# Altium schematic sheet SoC_BootMode.SchDoc
size A4; SheetNumber: 17; SheetTotal: 22
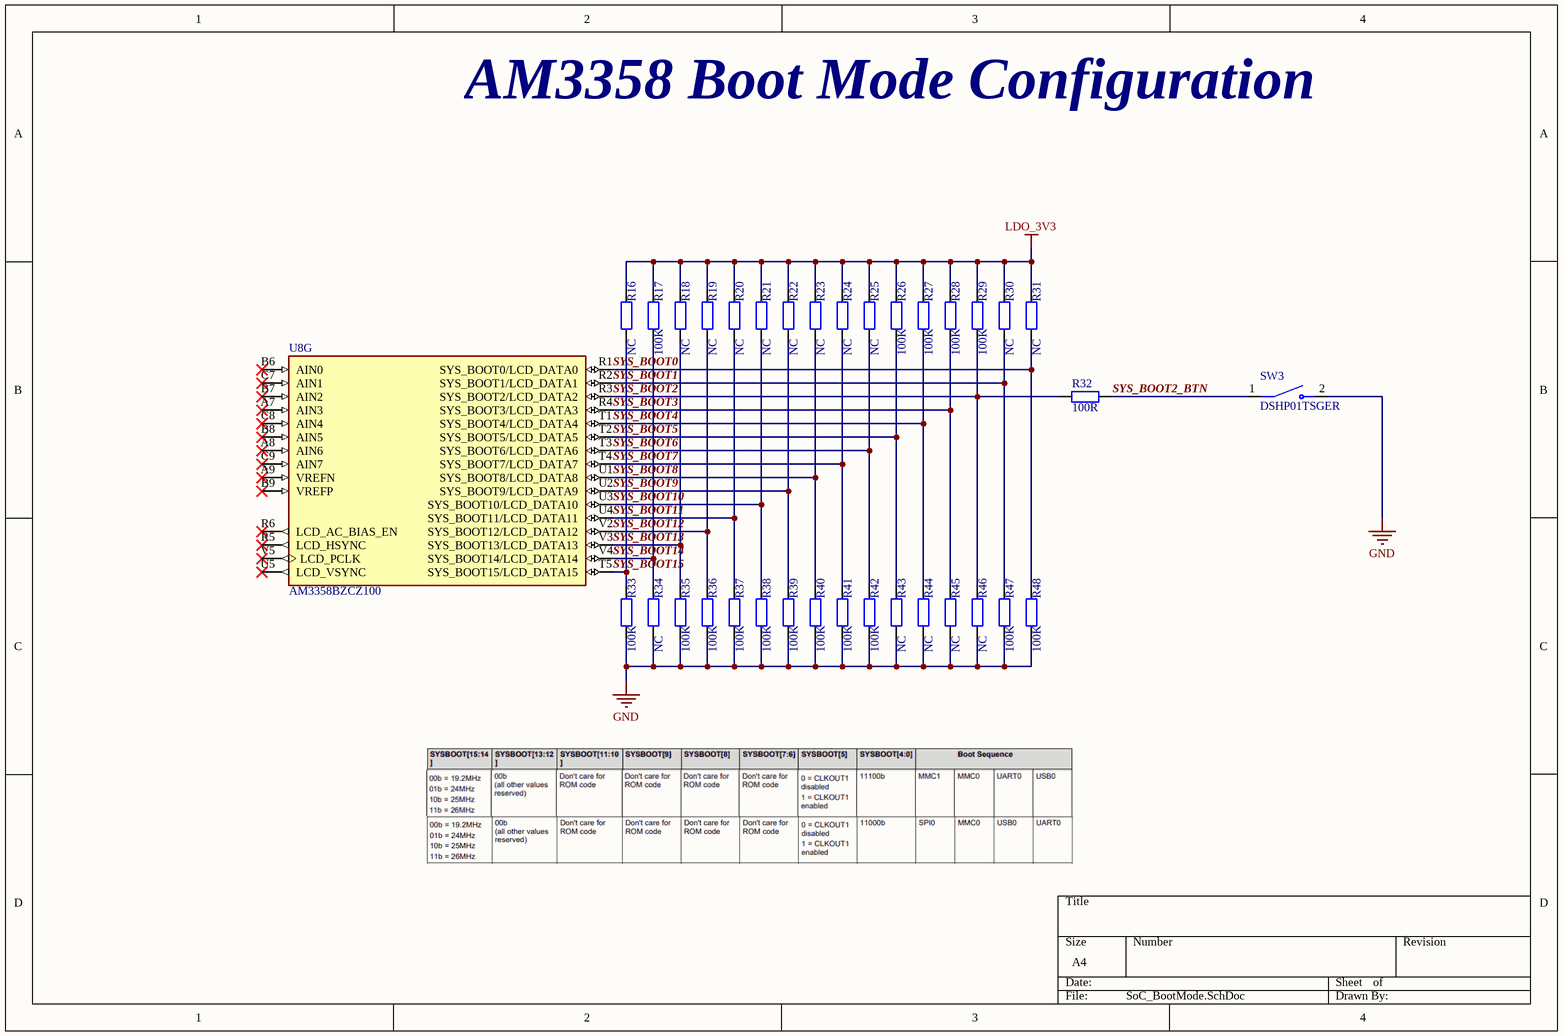
[diagram p0: SoC_BootMode.SchDoc]

## Parts
R16  NC  [R_0402]
R17  100K  [R_0402]
R18  NC  [R_0402]
R19  NC  [R_0402]
R20  NC  [R_0402]
R21  NC  [R_0402]
R22  NC  [R_0402]
R23  NC  [R_0402]
R24  NC  [R_0402]
R25  NC  [R_0402]
R26  100K  [R_0402]
R27  100K  [R_0402]
R28  100K  [R_0402]
R29  100K  [R_0402]
R30  NC  [R_0402]
R31  NC  [R_0402]
R32  100R  [R_0402]
R33  100K  [R_0402]
R34  NC  [R_0402]
R35  100K  [R_0402]
R36  100K  [R_0402]
R37  100K  [R_0402]
R38  100K  [R_0402]
R39  100K  [R_0402]
R40  100K  [R_0402]
R41  100K  [R_0402]
R42  100K  [R_0402]
R43  NC  [R_0402]
R44  NC  [R_0402]
R45  NC  [R_0402]
R46  NC  [R_0402]
R47  100K  [R_0402]
R48  100K  [R_0402]
SW3  DSHP01TSGER  [DSHP01TSGER]
U8  AM3358BZCZ100  [BGA324C80P18X18_1500X1500X140]  (part G of 9)

## Nets
GND: R33.1 R34.1 R35.1 R36.1 R37.1 R38.1 R39.1 R40.1 R41.1 R42.1 R43.1 R44.1 R45.1 R46.1 R47.1 R48.1 SW3.2(NO)
LDO_3V3: R16.2 R17.2 R18.2 R19.2 R20.2 R21.2 R22.2 R23.2 R24.2 R25.2 R26.2 R27.2 R28.2 R29.2 R30.2 R31.2
SYS_BOOT0: R31.1 R48.2 U8.R1(SYS_BOOT0/LCD_DATA0)
SYS_BOOT1: R30.1 R47.2 U8.R2(SYS_BOOT1/LCD_DATA1)
SYS_BOOT2: R29.1 R32.1 R46.2 U8.R3(SYS_BOOT2/LCD_DATA2)
SYS_BOOT2_BTN: R32.2 SW3.1(COM)
SYS_BOOT3: R28.1 R45.2 U8.R4(SYS_BOOT3/LCD_DATA3)
SYS_BOOT4: R27.1 R44.2 U8.T1(SYS_BOOT4/LCD_DATA4)
SYS_BOOT5: R26.1 R43.2 U8.T2(SYS_BOOT5/LCD_DATA5)
SYS_BOOT6: R25.1 R42.2 U8.T3(SYS_BOOT6/LCD_DATA6)
SYS_BOOT7: R24.1 R41.2 U8.T4(SYS_BOOT7/LCD_DATA7)
SYS_BOOT8: R23.1 R40.2 U8.U1(SYS_BOOT8/LCD_DATA8)
SYS_BOOT9: R22.1 R39.2 U8.U2(SYS_BOOT9/LCD_DATA9)
SYS_BOOT10: R21.1 R38.2 U8.U3(SYS_BOOT10/LCD_DATA10)
SYS_BOOT11: R20.1 R37.2 U8.U4(SYS_BOOT11/LCD_DATA11)
SYS_BOOT12: R19.1 R36.2 U8.V2(SYS_BOOT12/LCD_DATA12)
SYS_BOOT13: R18.1 R35.2 U8.V3(SYS_BOOT13/LCD_DATA13)
SYS_BOOT14: R17.1 R34.2 U8.V4(SYS_BOOT14/LCD_DATA14)
SYS_BOOT15: R16.1 R33.2 U8.T5(SYS_BOOT15/LCD_DATA15)

Not connected (* = marked no-connect by the designer): U8 A7(AIN3)* A8(AIN6)* A9(VREFN)* B6(AIN0)* B7(AIN2)* B8(AIN5)* B9(VREFP)* C7(AIN1)* C8(AIN4)* C9(AIN7)* R5(LCD_HSYNC)* R6(LCD_AC_BIAS_EN)* U5(LCD_VSYNC)* V5(LCD_PCLK)*

## Notes on the sheet
- AM3358 Boot Mode Configuration

## Library data of the parts
R16-R48 = R_0402: Resistor 0402 SMD
SW3 = DSHP01TSGER: 1 Digit SPST 24V Black 25mA 3000 Times SMD,2.9x5.4mm DIP Switches ROHS; Manufacturer: kangshen; Manufacturer Part Number: DSHP01TSGER; ComponentLink1Description: Datasheet Link; ComponentLink1URL: https://www.lcsc.com/datasheet/lcsc_datasheet_2411220122_kangshen-DSHP01TSGER_C3293141.pdf
U8 = AM3358BZCZ100: ARM-ASeries 1GHz NFBGA-324 Microcontrollers (MCU/MPU/SOC) ROHS; Manufacturer: Texas Instruments; Manufacturer Part Number: AM3358BZCZ100; Datasheet Link: https://www.ti.com/lit/ds/symlink/am3358.pdf